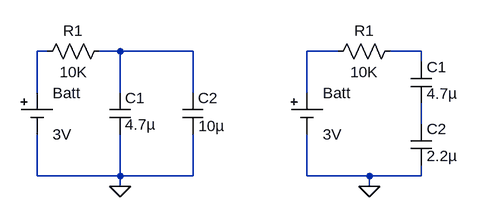
[diagram p0: schematic Parallel and Series Cap Networks.asc]
Parallel and Series Cap Networks.asc, the LTspice schematic file:
Version 4
SHEET 1 880 680
WIRE 48 64 32 64
WIRE 160 64 128 64
WIRE 272 64 160 64
WIRE 496 64 448 64
WIRE 624 64 576 64
WIRE 624 80 624 64
WIRE 32 128 32 64
WIRE 160 128 160 64
WIRE 272 128 272 64
WIRE 448 128 448 64
WIRE 624 176 624 144
WIRE 32 256 32 192
WIRE 160 256 160 192
WIRE 160 256 32 256
WIRE 272 256 272 192
WIRE 272 256 160 256
WIRE 448 256 448 192
WIRE 544 256 448 256
WIRE 624 256 624 240
WIRE 624 256 544 256
WIRE 160 272 160 256
WIRE 544 272 544 256
FLAG 544 272 0
FLAG 160 272 0
SYMBOL cap 144 128 R0
WINDOW 3 24 49 Left 2
SYMATTR InstName C1
SYMATTR Value 4.7µ
SYMATTR SpiceLine V=16 Irms=0 Rser=0 Lser=0 mfg="Murata" pn="GCM21BR71C475MA73" type="X7R"
SYMBOL cap 256 128 R0
WINDOW 3 25 51 Left 2
SYMATTR InstName C2
SYMATTR Value 10µ
SYMATTR SpiceLine V=25 Irms=7.16 Rser=0.00732742 Lser=0 mfg="KEMET" pn="C1206C106K3PAC" type="X5R"
SYMBOL Misc\\cell 32 128 R0
SYMATTR InstName Batt
SYMATTR Value 3V
SYMBOL Misc\\cell 448 128 R0
SYMATTR InstName Batt
SYMATTR Value 3V
SYMBOL cap 608 80 R0
WINDOW 3 24 49 Left 2
SYMATTR InstName C1
SYMATTR Value 4.7µ
SYMATTR SpiceLine V=16 Irms=0 Rser=0 Lser=0 mfg="Murata" pn="GCM21BR71C475MA73" type="X7R"
SYMBOL cap 608 176 R0
WINDOW 3 24 49 Left 2
SYMATTR InstName C2
SYMATTR Value 2.2µ
SYMATTR SpiceLine V=16 Irms=0 Rser=0 Lser=0 mfg="Murata" pn="GCM21BR71C225MA64" type="X7R"
SYMBOL res 144 48 R90
WINDOW 0 0 56 VBottom 2
WINDOW 3 32 56 VTop 2
SYMATTR InstName R1
SYMATTR Value 10K
SYMBOL res 592 48 R90
WINDOW 0 0 56 VBottom 2
WINDOW 3 32 56 VTop 2
SYMATTR InstName R1
SYMATTR Value 10K

The netlist it stands for:
* Parallel and Series Cap Networks.asc
C1 N002 0 4.7µ V=16 Irms=0 Rser=0 Lser=0 mfg="Murata" pn="GCM21BR71C475MA73" type="X7R"
C2 N002 0 10µ V=25 Irms=7.16 Rser=0.00732742 Lser=0 mfg="KEMET" pn="C1206C106K3PAC" type="X5R"
V§Batt N001 0 3V
V§Batt N003 0 3V
C1 N004 N005 4.7µ V=16 Irms=0 Rser=0 Lser=0 mfg="Murata" pn="GCM21BR71C475MA73" type="X7R"
C2 N005 0 2.2µ V=16 Irms=0 Rser=0 Lser=0 mfg="Murata" pn="GCM21BR71C225MA64" type="X7R"
R1 N002 N001 10K
R1 N004 N003 10K
.backanno
.end